# EAGLE design Solder Paste Controller (EAGLE 7.5.0)
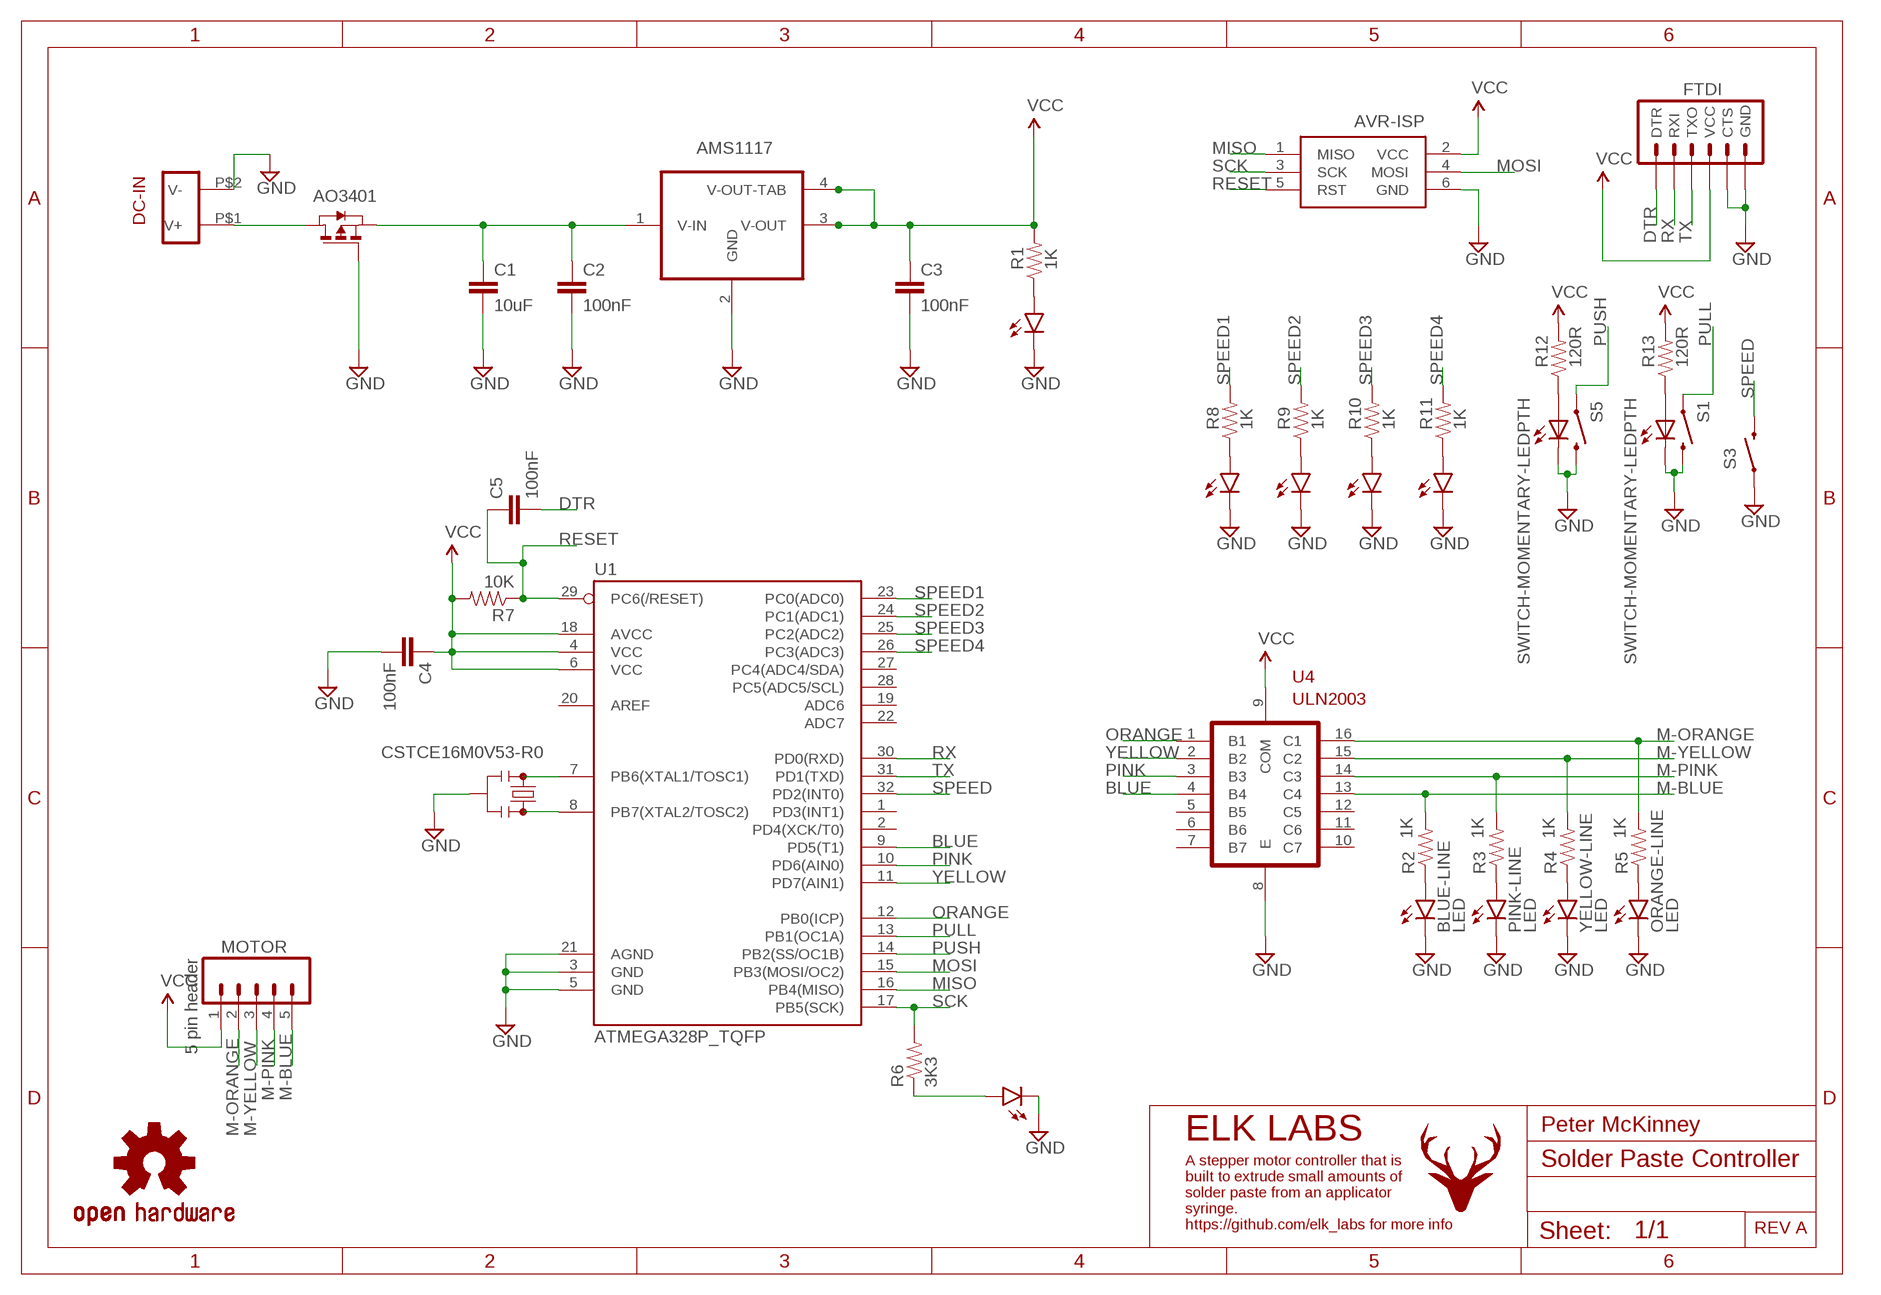
[diagram p0: schematic, sheet 1]

## Parts
AVR-ISP  AVRISP-6  [AVRISP]
BLUE-LINE  LED  [0805-LED]
C1  10uF  1UF-25V-10%(0805)  [0805]
C2  100nF  1UF-25V-10%(0805)  [0805]
C3  100nF  1UF-25V-10%(0805)  [0805]
C4  100nF  1UF-25V-10%(0805)  [0805]
C5  100nF  1UF-25V-10%(0805)  [0805]
CRYSTAL  CSTCE16M0V53-R0  [CSTCE_V]
DC-IN  red black twister wire  POWER-IN-WITH-RELIEF  [POWER_CONNECTOR_WITH_RELIEF]
FTDI  6 pin header  ARDUINO_SERIAL_PROGRAMPTH  [1X06]
HEARTBEAT  LED  [0805-LED]
LOGO1  OSHW-LOGOS  [OSHW-LOGO-S]
MOTOR  5 pin header  M05PTH  [1X05]
ORANGE-LINE  LED  [0805-LED]
PINK-LINE  LED  [0805-LED]
PWRLED  LED  [0805-LED]
R1  1K  RESISTOR0805-RES  [0805]
R2  1K  RESISTOR0805-RES  [0805]
R3  1K  RESISTOR0805-RES  [0805]
R4  1K  RESISTOR0805-RES  [0805]
R5  1K  RESISTOR0805-RES  [0805]
R6  3K3  RESISTOR0805-RES  [0805]
R7  10K  RESISTOR0805-RES  [0805]
R8  1K  RESISTOR0805-RES  [0805]
R9  1K  RESISTOR0805-RES  [0805]
R10  1K  RESISTOR0805-RES  [0805]
R11  1K  RESISTOR0805-RES  [0805]
R12  120R  RESISTOR0805-RES  [0805]
R13  120R  RESISTOR0805-RES  [0805]
S1  SWITCH-MOMENTARY-LEDPTH  [TACTILE-PTH-LED-12MM]
S3  SWITCH-MOMENTARY-2SMD-1101NE  [TACTILE-SWITCH-1101NE]
S5  SWITCH-MOMENTARY-LEDPTH  [TACTILE-PTH-LED-12MM]
SPEED1LED  LED  [0805-LED]
SPEED2LED  LED  [0805-LED]
SPEED3LED  LED  [0805-LED]
SPEED4LED  LED  [0805-LED]
U1  ATMEGA328P_TQFP  [TQFP32-08]
U2  AMS1117  [SOT-223]
U3  AO3401  [SOT-23]
U4  ULN2003  [SOP-16]
U$1  ELK-LOGO  [ELK-LOGO]
YELLOW-LINE  LED  [0805-LED]

## Nets
BLUE: U1.9(PD5(T1)) U4.4(B4)
DTR: C5.2 FTDI.1(DTR)
GND: AVR-ISP.6(GND) BLUE-LINE.C C1.2 C2.2 C3.2 C4.2 CRYSTAL.GND DC-IN.P$2(V-) FTDI.5(CTS) FTDI.6(GND) HEARTBEAT.C ORANGE-LINE.C PINK-LINE.C PWRLED.C S1.2 S1.C S3.1 S5.2 S5.C SPEED1LED.C SPEED2LED.C SPEED3LED.C SPEED4LED.C U1.3(GND) U1.5(GND) U1.21(AGND) U2.2(GND) U3.1(G) U4.8(E) YELLOW-LINE.C
M-BLUE: MOTOR.5 R2.2 U4.13(C4)
M-ORANGE: MOTOR.2 R5.2 U4.16(C1)
M-PINK: MOTOR.4 R3.2 U4.14(C3)
M-YELLOW: MOTOR.3 R4.2 U4.15(C2)
MISO: AVR-ISP.1(MISO) U1.16(PB4(MISO))
MOSI: AVR-ISP.4(MOSI) U1.15(PB3(MOSI/OC2))
N$1: C1.1 C2.1 U2.1(V-IN) U3.2(S)
N$3: PWRLED.A R1.1
N$4: CRYSTAL.1 U1.7(PB6(XTAL1/TOSC1))
N$5: CRYSTAL.3 U1.8(PB7(XTAL2/TOSC2))
N$6: DC-IN.P$1(V+) U3.3(D)
N$7: BLUE-LINE.A R2.1
N$8: PINK-LINE.A R3.1
N$9: R4.1 YELLOW-LINE.A
N$10: ORANGE-LINE.A R5.1
N$11: R12.1 S5.A
N$12: R13.1 S1.A
N$15: HEARTBEAT.A R6.1
N$16: R8.1 SPEED1LED.A
N$17: R9.1 SPEED2LED.A
N$18: R10.1 SPEED3LED.A
N$19: R11.1 SPEED4LED.A
ORANGE: U1.12(PB0(ICP)) U4.1(B1)
PINK: U1.10(PD6(AIN0)) U4.3(B3)
PULL: S1.4 U1.13(PB1(OC1A))
PUSH: S5.4 U1.14(PB2(SS/OC1B))
RESET: AVR-ISP.5(RST) C5.1 R7.1 U1.29(PC6(/RESET))
RX: FTDI.2(RXI) U1.30(PD0(RXD))
SCK: AVR-ISP.3(SCK) R6.2 U1.17(PB5(SCK))
SPEED: S3.2 U1.32(PD2(INT0))
SPEED1: R8.2 U1.23(PC0(ADC0))
SPEED2: R9.2 U1.24(PC1(ADC1))
SPEED3: R10.2 U1.25(PC2(ADC2))
SPEED4: R11.2 U1.26(PC3(ADC3))
TX: FTDI.3(TXO) U1.31(PD1(TXD))
VCC: AVR-ISP.2(VCC) C3.1 C4.1 FTDI.4(VCC) MOTOR.1 R1.2 R7.2 R12.2 R13.2 U1.4(VCC) U1.6(VCC) U1.18(AVCC) U2.3(V-OUT) U2.4(V-OUT-TAB) U4.9(COM)
YELLOW: U1.11(PD7(AIN1)) U4.2(B2)
Unconnected: U1.1(PD3(INT1)) U1.2(PD4(XCK/T0)) U1.19(ADC6) U1.20(AREF) U1.22(ADC7) U1.27(PC4(ADC4/SDA)) U1.28(PC5(ADC5/SCL)) U4.5(B5) U4.6(B6) U4.7(B7) U4.10(C7) U4.11(C6) U4.12(C5)

## Notes on the sheet
- Peter McKinney
- ELK LABS
- A stepper motor controller that is
  built to extrude small amounts of
  solder paste from an applicator 
  syringe. 
  https://github.com/elk_labs for more info
- REV A

## Library data of the parts
AVR-ISP = adafruit:AVRISP: AVR ISP HEADER Standard 6 pin header for AVR programming
BLUE-LINE HEARTBEAT ORANGE-LINE PINK-LINE PWRLED SPEED1LED SPEED2LED SPEED3LED SPEED4LED YELLOW-LINE = ELK LABS:LED: STANDARD LED A standard LED, available in various packages and colours. Purchace Link. <http://www.ebay.ie/sch/i.html?_from=R40&_trksid=p2047675.m570.l1313.TR0.TRC0.H0.Xled.TRS0&_nkw=led&_sacat=0>
C1-C5 = SparkFun-Capacitors:1UF-25V-10%(0805): CAP-08064; PROD_ID: CAP-08064; VALUE: 1uF
CRYSTAL = ELK LABS:CSTCE16M0V53-R0: CSTCE16M0V53-R0 16Mhz Ceramic Resonator Chip type CERALOCK with built-in load capacitors provides an extremely small package. MURATA's package technology expertise has enabled the development of the Chip CERALOCKr with built-in load capacitors. High-density mounting can be realized because of the small package and the elimination of the need for an external load capacitor. Datasheet available here. <http://www.mouser.com/ds/2/281/p16e-522700.pdf> Purchace link. <http://www.ebay.ie/itm/10pcs-CSTCE16M0V53-RO-Ceramic-Crystal-SMD-16MHZ-SMD-3-16-000MHZ-/251649435752?hash=item3a9779a868:g:pfIAAOSwQItUGoW3>
DC-IN = ELK LABS:POWER-IN-WITH-RELIEF: Power Input with built in cable relief
FTDI = SparkFun-Connectors:ARDUINO_SERIAL_PROGRAM: FTDI connector footprints
LOGO1 = SparkFun-Aesthetics:OSHW-LOGO: Open Source Hardware Logo This logo indicates the piece of hardware it is found on incorporates a OSHW license and/or adheres to the definition of open source hardware found here: http://freedomdefined.org/OSHW
MOTOR = SparkFun-Connectors:M05: Header 5 Standard 5-pin 0.1" header. Use with straight break away headers (SKU : PRT-00116), right angle break away headers (PRT-00553), swiss pins (PRT-00743), machine pins (PRT-00117), and female headers (PRT-00115). Molex polarized connector foot print use with SKU : PRT-08230 with associated crimp pins and housings.
R1-R13 = SparkFun-Passives:RESISTOR: Resistor Basic schematic elements and footprints for 0603, 1206, and PTH resistors.
S1 S5 = Local Library:SWITCH-MOMENTARY-LED
S3 = SparkFun-Electromechanical:SWITCH-MOMENTARY-2: Various NO switches- pushbuttons, reed, etc; PROD_ID: SWCH-00815
U1 = SparkFun-DigitalIC:ATMEGA328P_TQFP; PROD_ID: IC-09069
U2 = ELK LABS:AMS1117: AMS1117 Low Dropout Voltage Regulator - Fixed voltage version The The AMS1117 series of adjustable and fixed voltage regulators are designed to provide up to1A output current and to operate down to 1V input-to-output differential. The dropout voltage of the device is guaranteed maximum 1.3V, decreasing at lower load currents. On-chip trimming adjusts the reference voltage to 1.5%. Current limit is set to minimize the stress under overload conditions on both the regulator and power source circuitry. The AMS1117 devices are pin compatible with other three-terminal SCSI regulators and are offered in the low profile surface mount SOT-223 package, in the 8L SOIC package and in the TO-252 (DPAK) plastic package. Datasheet available here. <http://www.advanced-monolithic.com/pdf/ds1117.pdf> Purchace link. <http://www.ebay.ie/itm/20PCS-AMS1117-AMS117-5-0-5-0V-1A-Voltage-Regulator-SOT-223-NEW-GOOD-QUALITY-/141732411158?hash=item20ffe8f716:g:JQkAAOSwPcVVux1n>
U3 = ELK LABS:AO3401: AO3401 P-Channel Enhancement Mode Field Effect Transistor The AO3401 uses advanced trench technology to provide excellent RDS(ON), low gate charge and operation with gate voltages as low as 2.5V. This device is suitable for use as a load switch or in PWM applications. Datasheet available here. <http://www.aosmd.com/pdfs/datasheet/AO3401.pdf> Purchace Link. <http://www.ebay.ie/itm/100PCS-AO3401-SOT-23-P-Channel-MOSFET-TRANSISTORS-NEW-GOOD-QUALITY-/301724548271?hash=item46402f3caf:g:O00AAOSwcu5UMgfU>
U4 = ELK LABS:ULN2003: ULN2003A High-Voltage, High-Current Darlington Transistor Array The ULx200xA devices are high-voltage, high-current Darlington transistor arrays. Each consists of seven NPN Darlington pairs that feature high-voltage outputs with common-cathode clamp diodes for switching inductive loads. The collector-current rating of a single Darlington pair is 500 mA. The Darlington pairs can be paralleled for higher current capability. Applications include relay drivers, hammer drivers, lamp drivers, display drivers (LED and gas discharge), line drivers, and logic buffers. For 100-V (otherwise interchangeable) versions of the ULx2003A devices, see the SLRS023 data sheet for the SN75468 and SN75469 devices. Datasheet available here. <http://www.ti.com/lit/ds/symlink/uln2003a.pdf> Purchace link. <http://www.ebay.ie/itm/272041592948?_trksid=p2060353.m2749.l2649&ssPageName=STRK%3AMEBIDX%3AIT>
U$1 = ELK LABS:ELK-LOGO: ELK Labs Logo

## Board
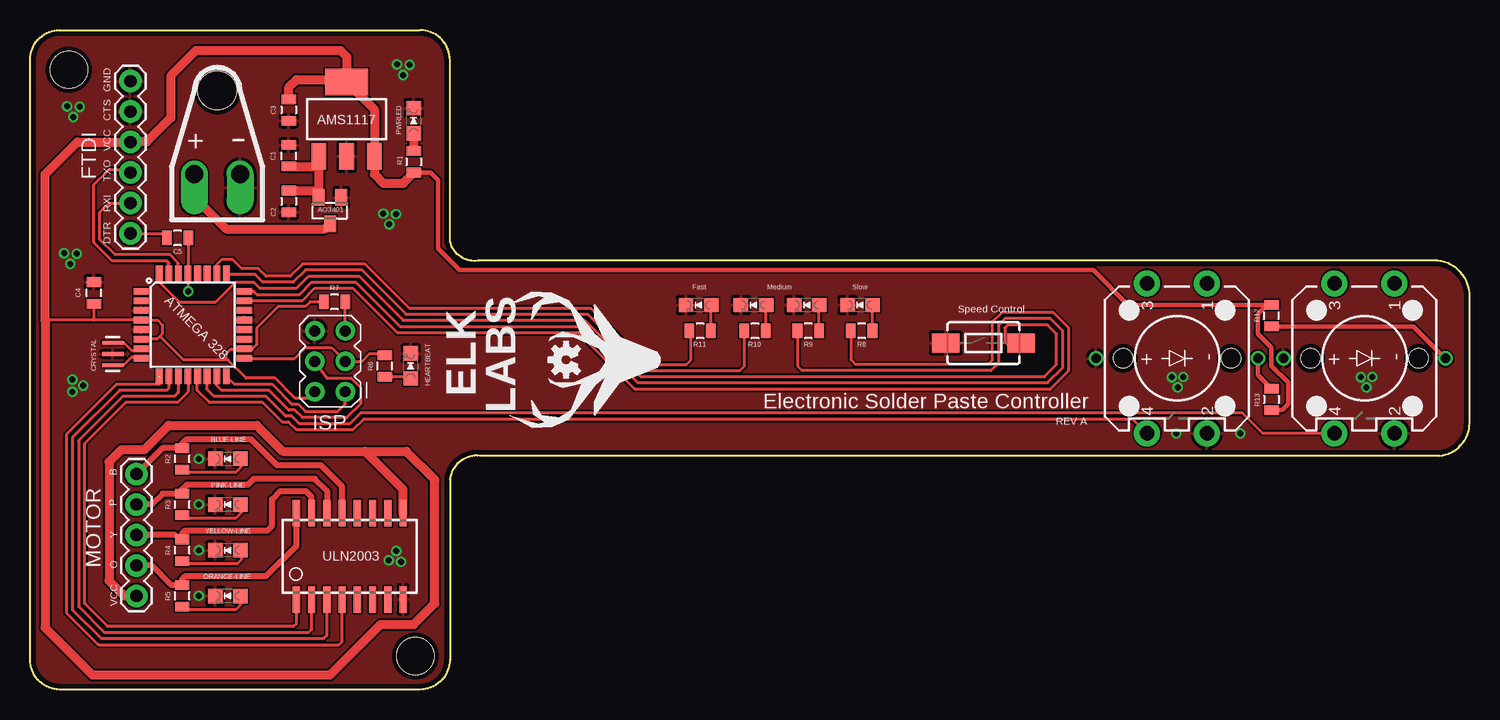
[diagram p1: board, top side]
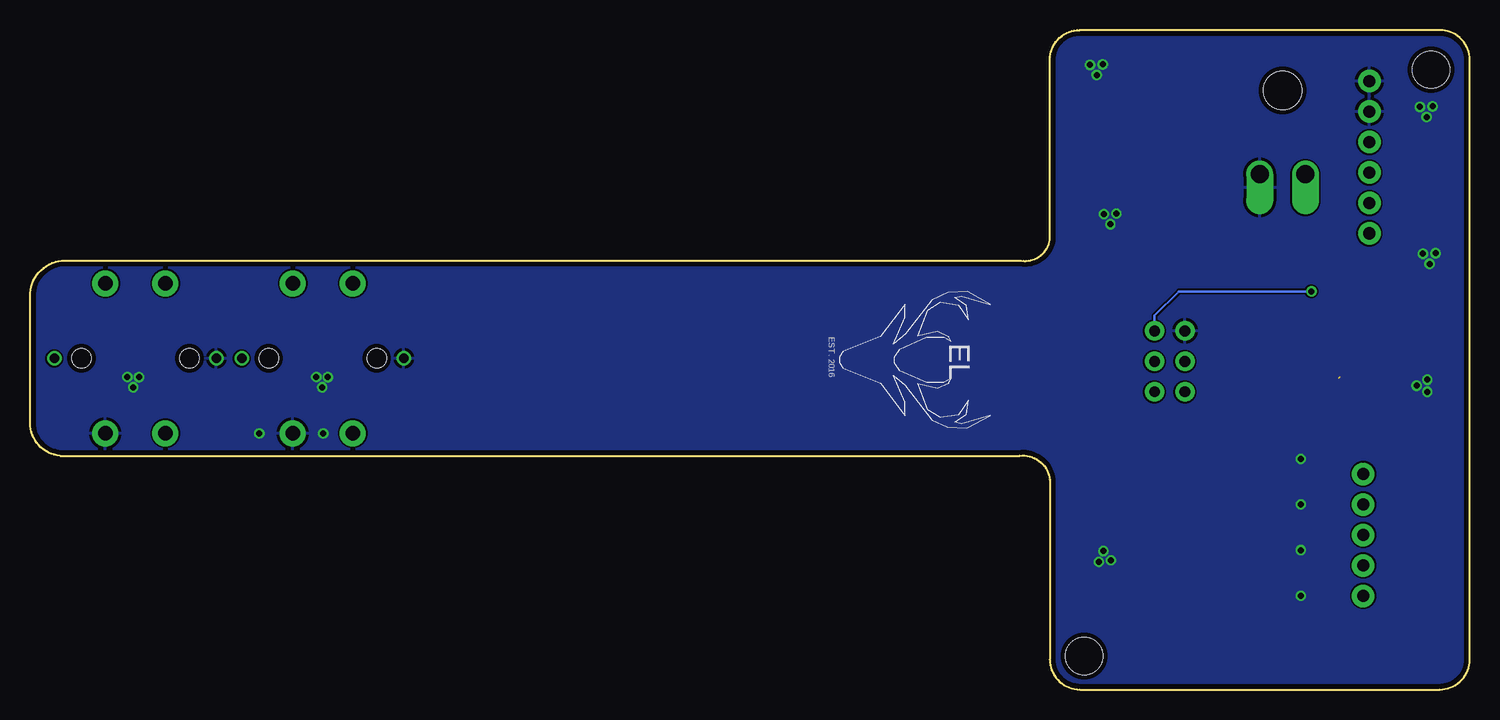
[diagram p2: board, bottom side, seen from below]

Size 120.02 x 55 mm. Coordinates in mm from the lower left corner, seen from the top.
Outline: 117.5,19.49 arc90 120,22.5 120,32.5 arc90 117.37,35.76 37.37,35.76 arc-90 35,37.5 35,52.5 arc90 32.5,55 2.5,55 arc90 0,52.5 0,2.5 arc90 2.5,0 32.5,0 arc90 35,2.5 35,17.5 arc-90 37.5,19.49 117.5,19.49
Copper layers (1*16): Top 0.0356mm / dielectric 1.5011mm / Bottom 0.0356mm
Design rules "LaenPCBOrder": minimum track width 6mil, minimum drill 13mil, track to track 6mil, track to pad 6mil, pad to pad 6mil, via to via 6mil, smd to smd 6mil, copper to edge 15mil, drill to drill 6mil, minimum pad ring 7mil, minimum via ring 7mil, stop-mask expansion 3mil, vias tented up to drill 0mil, thermal gap 10mil
Holes 3.1 mm at 32.14,2.78 3.23,51.68

### Footprints (pad centres in the part's own frame; a part is rotated, then mirrored left to right if it is on the bottom)
AVRISP = drill 0.9 pad 1.626: 1 -1.27,2.54; 2 1.27,2.54; 3 -1.27,0; 4 1.27,0; 5 -1.27,-2.54; 6 1.27,-2.54
0805-LED = smd 1.2 x 1.2: A 0,-1.05; C 0,1.05
0805 = smd 0.8 x 1.2: 1 -0.9,0; 2 0.9,0
CSTCE_V = smd 0.3 x 1.8: 1 -0.925,0.061; 3 0.975,0.061; GND 0.025,0.061
POWER_CONNECTOR_WITH_RELIEF = drill 1.5 offset: P$1 -1.905,0; P$2 1.905,0 | hole 3.2: 0,6.985
1X06 = drill 1.016 pad 1.88: 1 0,0; 2 2.54,0; 3 5.08,0; 4 7.62,0; 5 10.16,0; 6 12.7,0
1X05 = drill 1.016 pad 1.88: 1 0,0; 2 2.54,0; 3 5.08,0; 4 7.62,0; 5 10.16,0
TACTILE-PTH-LED-12MM = drill 1.2 pad 2.159: 1 -6.25,2.5; 2 6.25,2.5; 3 -6.25,-2.5; 4 6.25,-2.5 | drill 0.8: A 0,6.75; C 0,-6.75 | hole 1.6: 0,4.5; 0,-4.5
TACTILE-SWITCH-1101NE = smd 2.3 x 1.6: 1 -3.15,0; 2 3.15,0
TQFP32-08 = smd 1.27 x 0.559: 1 -4.293,2.8; 2 -4.293,2; 3 -4.293,1.2; 4 -4.293,0.4; 5 -4.293,-0.4; 6 -4.293,-1.2; 7 -4.293,-2; 8 -4.293,-2.8; 17 4.293,-2.8; 18 4.293,-2; 19 4.293,-1.2; 20 4.293,-0.4; 21 4.293,0.4; 22 4.293,1.2; 23 4.293,2; 24 4.293,2.8 | smd 0.559 x 1.27: 9 -2.8,-4.293; 10 -2,-4.293; 11 -1.2,-4.293; 12 -0.4,-4.293; 13 0.4,-4.293; 14 1.2,-4.293; 15 2,-4.293; 16 2.8,-4.293; 25 2.8,4.293; 26 2,4.293; 27 1.2,4.293; 28 0.4,4.293; 29 -0.4,4.293; 30 -1.2,4.293; 31 -2,4.293; 32 -2.8,4.293
SOT-223 = smd 1.219 x 2.235: 1 -2.311,-3.099; 2 0,-3.099; 3 2.311,-3.099 | smd 3.6 x 2.2: 4 0,3.099
SOT-23 = smd 1 x 1.4: 1 -0.95,-1.1; 2 0.95,-1.1; 3 0,1.1
SOP-16 = smd 0.6 x 2.2: 1 -4.445,-3.6; 2 -3.175,-3.6; 3 -1.905,-3.6; 4 -0.635,-3.6; 5 0.635,-3.6; 6 1.905,-3.6; 7 3.175,-3.6; 8 4.445,-3.6; 9 4.445,3.6; 10 3.175,3.6; 11 1.905,3.6; 12 0.635,3.6; 13 -0.635,3.6; 14 -1.905,3.6; 15 -3.175,3.6; 16 -4.445,3.6

### Placement (x,y rotation side)
AVR-ISP  25,27.37 180 top
BLUE-LINE  16.5,19.24 90 top
C1  21.57,44.51 90 top
C2  21.57,40.7 270 top
C3  21.57,48.32 270 top
C4  5.32,33.08 90 top
C5  12.3,37.65 180 top
CRYSTAL  6.84,28 270 top
DC-IN  15.61,42.99 0 top
FTDI  8.37,38.03 90 top
HEARTBEAT  31.73,26.98 0 top
LOGO1  44.69,27.49 90 top
MOTOR  8.88,7.81 90 top
ORANGE-LINE  16.5,7.81 90 top
PINK-LINE  16.5,15.43 90 top
PWRLED  31.99,47.43 0 top
R1  31.99,44 270 top
R2  12.68,19.24 90 top
R3  12.68,15.43 90 top
R4  12.68,11.62 90 top
R5  12.68,7.81 90 top
R6  29.58,26.98 90 top
R7  25.38,32.32 180 top
R8  69.33,29.91 180 top
R9  64.88,29.91 180 top
R10  60.44,29.91 180 top
R11  55.87,29.91 180 top
R12  103.49,31.18 90 top
R13  103.49,24.19 270 top
S1  95.62,27.62 270 top
S3  79.49,28.89 0 top
S5  111.24,27.62 270 top
SPEED1LED  69.2,32.06 90 top
SPEED2LED  64.75,32.06 90 top
SPEED3LED  60.31,32.06 90 top
SPEED4LED  55.74,32.06 90 top
U1  13.57,30.41 0 top
U2  26.4,47.56 0 top
U3  25,39.94 180 top
U4  26.66,11.11 0 top
U$1  52.56,21.14 90 top
YELLOW-LINE  16.5,11.62 90 top

### Tracks (layer width: path | path; a pad name or v marks a point on that pad's centre or on a via)
BLUE  (1 unrouted)
  Top 0.254: 10.91,25.99 10.91,25.59 10.78,25.46 7.22,25.46 3.03,21.27 3.03,6.41 5.7,3.74 25.77,3.74 26.02,4 U4.4
DTR
  Top 0.254: FTDI.1 11.28,38.03 C5.2
GND  (via drill 0.5)
  other vias: 29.96,38.8 30.5,39.65 29.45,39.68 30.54,11.54 29.91,10.78 30.92,10.65 111.9,26.07 110.93,26.05 3.54,25.84 3.54,24.83 111.41,25.21 4.43,25.33 14.08,19.24 14.08,15.43 14.08,11.62 14.08,7.81 95.57,21.35 100.9,21.35 96.15,26.07 95.18,26.05 95.67,25.21 31.1,51.24 31.65,52.09 30.59,52.13 3.6,47.74 4.15,48.59 3.09,48.63 3.35,35.49 3.9,36.34 2.84,36.38
  pour Top: 121.78,58.35 121.78,-3.11 -1.28,-3.11 -1.79,58.99
  pour Bottom: -3.57,58.48 -3.57,-5.65 54.47,-5.65 54.47,7.43 132.57,7.43 132.57,44.13 106.92,44.13 106.92,62.8 13.96,62.8 13.96,58.48
M-BLUE
  Top 0.508: MOTOR.5 11.04,20.14 R2.2 12.68,20.51 13.07,20.89 18.4,20.89 20.56,18.73 24.25,18.73 26.02,16.95 U4.13
M-ORANGE
  Top 0.508: MOTOR.2 10.14,10.35 11.79,8.71 R5.2 12.68,9.21 12.94,9.46 19.67,9.46 22.21,12 U4.16
M-PINK
  Top 0.508: MOTOR.4 10.14,15.43 11.04,16.33 R3.2 12.68,16.7 13.07,17.08 18.15,17.08 18.65,17.58 23.74,17.58 24.75,16.57 U4.14
M-YELLOW
  Top 0.508: MOTOR.3 9.89,12.89 12.04,12.9 R4.2 12.68,13.01 12.94,13.27 19.8,13.27 20.18,13.65 20.18,15.86 20.86,16.55 23,16.55 23.45,16.09 23.45,14.73 U4.15
MISO
  Top 0.254: U1.16 17.03,25.46 20.18,25.46 21.83,23.81 22.34,23.81 22.97,23.18 25.64,23.18 26.27,23.81 AVR-ISP.1
MOSI
  Top 0.254: AVR-ISP.4 24.75,25.97 26.78,25.97 27.54,25.21 27.54,23.81 26.4,22.67 22.72,22.67 22.08,23.3 21.57,23.3 19.92,24.95 15.99,24.95 15.57,25.37 U1.15
N$1
  Top 0.762: U3.2 24.09,41.07 24.09,41.59 | 24.09,41.59 24.09,43.62 | 24.09,43.62 U2.1 | C1.1 24.09,43.62 | C2.1 21.59,41.59 24.09,41.59
N$3
  Top 0.762: PWRLED.A R1.1
N$4
  Top 0.254: 9.25,28.38 U1.7 9.12,28.26 8.49,28.26 7.82,28.93 CRYSTAL.1
N$5
  Top 0.254: CRYSTAL.3 7.77,27.03 8.49,27.75 9.15,27.75 U1.8
N$6
  Top 0.762: DC-IN.P$1 13.7,41.08 16.37,38.41 24.58,38.41 U3.3
N$7
  Top 0.254: BLUE-LINE.A 17.54,18.51 17.13,18.1 12.93,18.1 R2.1
N$8
  Top 0.254: PINK-LINE.A 17.54,14.7 17.13,14.29 12.93,14.29 R3.1
N$9
  Top 0.254: YELLOW-LINE.A 17.64,11.4 17.64,10.86 17.26,10.47 12.93,10.47 R4.1 12.81,10.59
N$10
  Top 0.254: ORANGE-LINE.A 17.54,7.08 17.13,6.67 12.93,6.67 R5.1
N$11
  Top 0.381: R12.1 115.33,30.28 S5.A
N$12
  Top 0.381: S1.A 102.37,26.21 R13.1
N$15
  Top 0.254: R6.1 31.59,26.09 HEARTBEAT.A
N$16
  Top 0.254: R8.1 70.23,32.04 SPEED1LED.A
N$17
  Top 0.254: R9.1 65.78,32.04 SPEED2LED.A
N$18
  Top 0.254: R10.1 61.34,32.04 SPEED3LED.A
N$19
  Top 0.254: R11.1 56.77,32.04 SPEED4LED.A
ORANGE
  Top 0.254: U1.12 13.17,24.97 13.19,24.95 13.19,24.83 12.3,23.94 7.99,23.94 4.56,20.51 4.56,7.17 6.46,5.27 21.96,5.27 22.21,5.52 U4.1
PINK
  Top 0.254: U1.10 11.57,25.11 11.41,24.95 7.48,24.95 3.54,21.02 3.54,6.67 5.95,4.25 24.5,4.25 24.75,4.51 U4.3
PULL
  Top 0.254: U1.13 13.96,26.1 13.96,24.95 14.97,23.94 19.42,23.94 21.07,22.29 21.57,22.29 22.21,21.65 26.91,21.65 27.8,22.54 91.95,22.54 S1.4
PUSH
  Top 0.254: U1.14 14.72,26.06 14.72,25.08 15.35,24.45 19.67,24.45 21.32,22.79 21.83,22.79 22.46,22.16 26.66,22.16 27.54,23.05 101.08,23.05 102.73,21.4 108.71,21.4 S5.4
RESET  (via drill 0.5)
  Top 0.2: R7.1 AVR-ISP.5 | 13.2,34.74 13.19,34.74 v13.19,33.21
  Top 0.254: AVR-ISP.5 R7.1 | C5.1 13.2,34.74 U1.29
  Bottom 0.2: v13.19,33.21 24.24,33.21 26.27,31.18 AVR-ISP.5
RX
  Top 0.254: U1.30 12.37,35.55 11.67,36.26 7.1,36.26 5.83,37.53 5.83,39.81 6.59,40.57 FTDI.2
SCK
  Top 0.254: U1.17 22.08,27.62 22.97,28.51 25.13,28.51 AVR-ISP.3 27.67,27.37 28.31,28 29.46,28 R6.2
SPEED
  Top 0.254: U1.32 10.78,34.45 10.78,33.97 12.43,32.32 15.48,32.32 17.13,33.97 18.65,33.97 19.16,33.46 22.21,33.46 23.23,34.48 27.42,34.48 31.1,30.8 46.21,30.8 50.91,26.1 84.57,26.1 85.58,27.11 85.58,29.65 84.82,30.41 81.52,30.41 81.27,30.16 81.27,29.02 81.52,28.76 82.51,28.76 S3.2
SPEED1
  Top 0.254: U1.23 17.9,32.45 22.72,32.45 23.73,33.46 26.91,33.46 30.59,29.78 45.7,29.78 50.4,25.08 85.08,25.08 86.6,26.6 86.6,30.16 85.33,31.43 81.01,31.43 80.25,30.67 80.25,27.49 79.87,27.11 68.82,27.11 68.43,27.5 R8.2
SPEED2
  Top 0.254: U1.24 18.65,33.21 18.91,32.95 22.46,32.95 23.48,33.97 27.16,33.97 30.85,30.29 45.96,30.29 50.66,25.59 84.82,25.59 86.09,26.86 86.09,29.91 85.08,30.92 81.27,30.92 80.76,30.41 80.76,27.24 80.12,26.6 64.37,26.6 63.98,27 R9.2
SPEED3
  Top 0.254: 16.4,34.73 U1.25 16.48,34.6 18.78,34.6 19.42,33.97 21.96,33.97 22.97,34.99 27.67,34.99 31.35,31.3 46.47,31.3 51.17,26.6 59.17,26.6 59.55,26.98 59.55,29.89 R10.2
SPEED4
  Top 0.254: U1.26 15.61,34.74 15.61,35.49 15.99,35.88 16.88,35.88 17.64,35.11 19.04,35.11 19.67,34.48 21.7,34.48 22.72,35.49 27.93,35.49 31.61,31.81 46.72,31.81 51.42,27.11 54.72,27.11 55.1,27.49 55.1,29.77 R11.2
TX
  Top 0.254: U1.31 11.57,35.59 11.41,35.75 6.84,35.75 5.32,37.27 5.32,42.1 6.59,43.37 8.11,43.37 FTDI.3
VCC
  Top 0.254: U1.4 9.26,30.8 | 9.26,30.8 5.32,30.8 | 5.32,30.8 1.26,30.8 | 9.26,30.8 10.65,30.8 11.03,30.41 11.03,29.65 10.91,29.53 | 10.91,29.53 10.6,29.21 U1.6 | 10.91,29.53 10.91,29.4 12.81,27.49 16.5,27.49 | C4.1 5.32,30.8 | U1.18 17.95,28.5 | 16.5,27.49 16.37,27.62 16.37,28 16.75,28.38 17.84,28.38 U1.18 | 16.5,27.49 18.02,25.97 20.43,25.97 22.08,24.32 23.23,24.32 AVR-ISP.2 | U1.18 17.9,28.38 18.53,28.38 18.91,28.76 18.91,30.16 20.69,31.94 22.97,31.94 23.35,32.32 R7.2 | 32,43.11 R1.2 | R12.2 103.12,32.08 | 103.5,23.3 R13.2
  Top 0.381: R12.2 91.54,32.08 88.63,34.99 35.8,34.99 34.02,36.76 34.02,42.48 33.39,43.11 32,43.11 | 103.12,32.08 102.35,31.3 102.35,29.65 103.49,28.51 103.49,26.98 104.89,25.59 104.89,23.81 104.38,23.3 103.5,23.3
  Top 0.762: MOTOR.1 7.86,7.81 6.59,9.08 6.59,18.98 7.61,20 9.51,20 11.54,22.03 18.91,22.03 21.07,19.87 27.93,19.87 | U2.4 28.71,48.35 U2.3 28.71,42.96 29.45,42.22 31.11,42.22 R1.2 | U2.4 26.4,52.77 25.89,53.27 13.82,53.27 11.73,51.18 11.73,47.68 9.73,45.68 8.4,45.68 FTDI.4 3.95,45.65 1.26,42.97 1.26,30.8 1.26,5.15 5.2,1.21 25.01,1.21 29.23,5.43 31.98,5.43 33.73,7.18 33.73,17.43 33.77,17.46 31.36,19.87 27.93,19.87 | 25.38,50.86 25.59,50.66 25.89,50.66 | 25.89,50.66 U2.4 | C3.1 21.57,50.23 22.21,50.86 25.69,50.86 25.89,50.66 | U4.9 31.1,16.7 27.93,19.87
YELLOW
  Top 0.254: U1.11 12.37,24.77 12.05,24.45 7.73,24.45 4.05,20.76 4.05,6.92 6.21,4.76 23.23,4.76 23.48,5.01 U4.2 23.61,7.13

### Text on the board
tPlace: GND | CTS | VCC | TXO | RXI | DTR | Fast | Medium | Slow | Speed Control | ATMEGA 328 | ELK | Electronic Solder Paste Controller | LABS | REV A | B | P | Y | O | VCC
bPlace: EL | EST. 2016
tNames: ISP